# Altium schematic sheet Avalon_BP.SchDoc
size A4
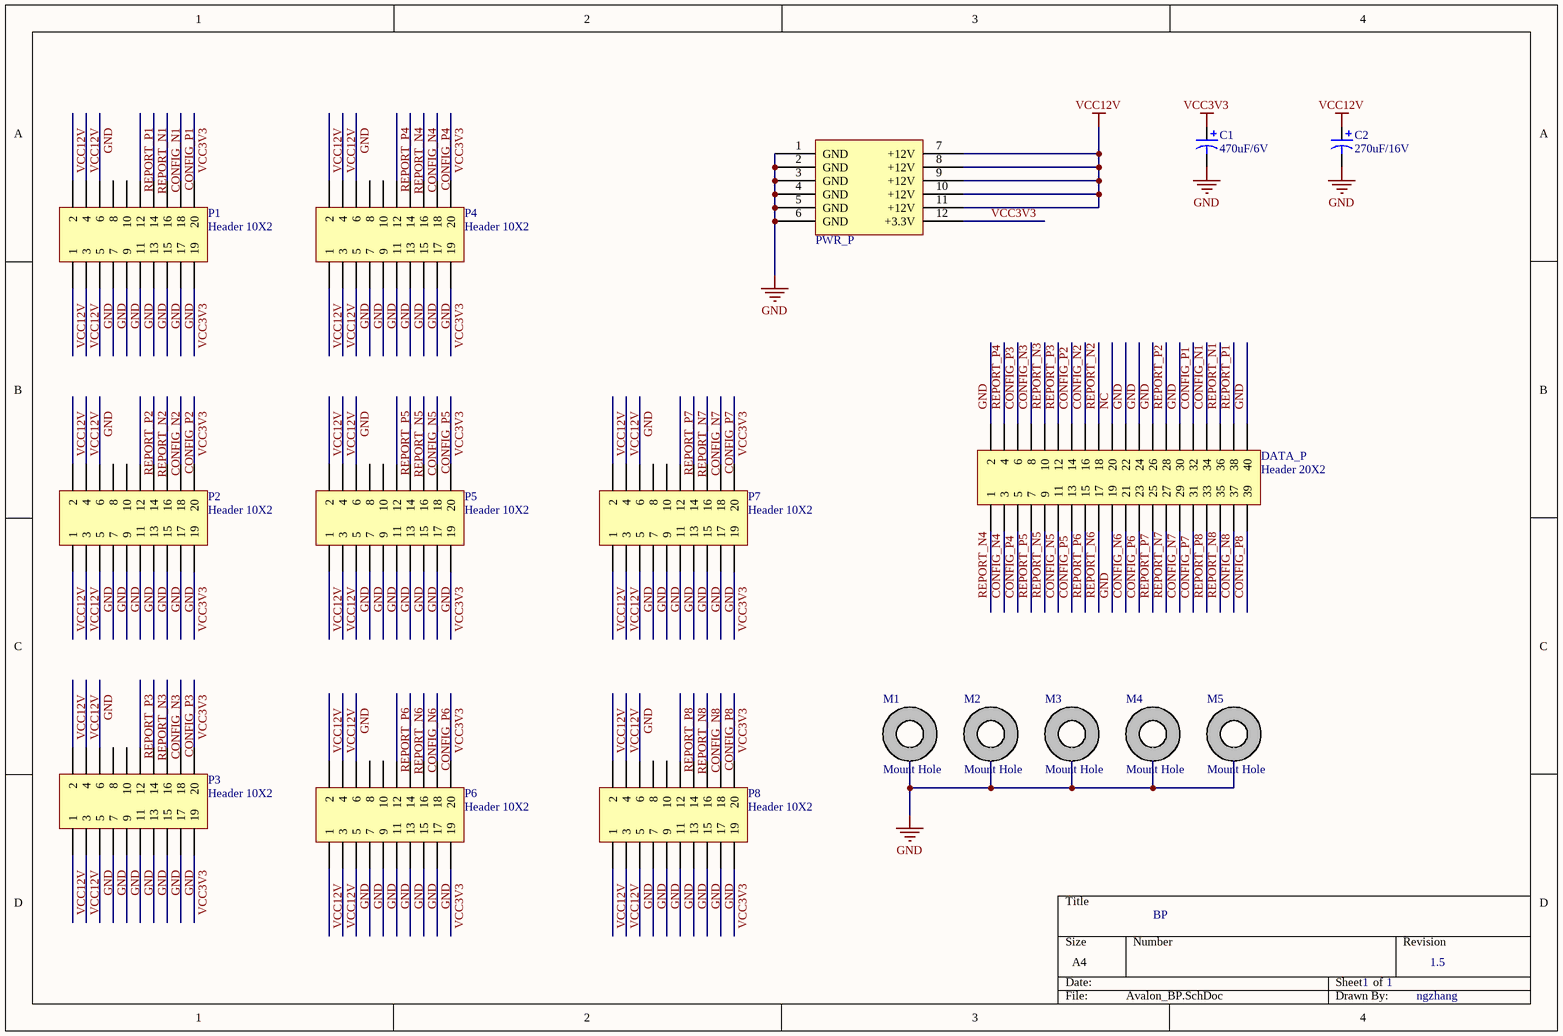
[diagram p0: Avalon_BP.SchDoc]

## Parts
C1  470uF/6V  [CAP8X8]
C2  270uF/16V  [CAP8X8]
DATA_P  Header 20X2  [IDE40]
M1  Mount Hole  [MHOLE3]
M2  Mount Hole  [MHOLE3]
M3  Mount Hole  [MHOLE3]
M4  Mount Hole  [MHOLE3]
M5  Mount Hole  [MHOLE3]
P1  Header 10X2  [HDR2X10]
P2  Header 10X2  [HDR2X10]
P3  Header 10X2  [HDR2X10]
P4  Header 10X2  [HDR2X10]
P5  Header 10X2  [HDR2X10]
P6  Header 10X2  [HDR2X10]
P7  Header 10X2  [HDR2X10]
P8  Header 10X2  [HDR2X10]
PWR_P  PWR_12P  [PWR_12PIN]  (value not drawn)

## Nets
GND: C1.2 C2.2 DATA_P.2 DATA_P.19 DATA_P.22 DATA_P.24 DATA_P.26 DATA_P.30 DATA_P.40 M1.0(PIN) M2.0(PIN) M3.0(PIN) M4.0(PIN) M5.0(PIN) P1.5 P1.6 P1.7 P1.9 P1.11 P1.13 P1.15 P1.17 P2.5 P2.6 P2.7 P2.9 P2.11 P2.13 P2.15 P2.17 P3.5 P3.6 P3.7 P3.9 P3.11 P3.13 P3.15 P3.17 P4.5 P4.6 P4.7 P4.9 P4.11 P4.13 P4.15 P4.17 P5.5 P5.6 P5.7 P5.9 P5.11 P5.13 P5.15 P5.17 P6.5 P6.6 P6.7 P6.9 P6.11 P6.13 P6.15 P6.17 P7.5 P7.6 P7.7 P7.9 P7.11 P7.13 P7.15 P7.17 P8.5 P8.6 P8.7 P8.9 P8.11 P8.13 P8.15 P8.17 PWR_P.1(GND) PWR_P.2(GND) PWR_P.3(GND) PWR_P.4(GND) PWR_P.5(GND) PWR_P.6(GND)
VCC3V3: C1.1 P1.19 P1.20 P2.19 P2.20 P3.19 P3.20 P4.19 P4.20 P5.19 P5.20 P6.19 P6.20 P7.19 P7.20 P8.19 P8.20 PWR_P.12(+3.3V)
VCC12V: C2.1 P1.1 P1.2 P1.3 P1.4 P2.1 P2.2 P2.3 P2.4 P3.1 P3.2 P3.3 P3.4 P4.1 P4.2 P4.3 P4.4 P5.1 P5.2 P5.3 P5.4 P6.1 P6.2 P6.3 P6.4 P7.1 P7.2 P7.3 P7.4 P8.1 P8.2 P8.3 P8.4 PWR_P.7(+12V) PWR_P.8(+12V) PWR_P.9(+12V) PWR_P.10(+12V) PWR_P.11(+12V)
CONFIG_N1: DATA_P.34 P1.16
CONFIG_N2: DATA_P.16 P2.16
CONFIG_N3: DATA_P.8 P3.16
CONFIG_N4: DATA_P.3 P4.16
CONFIG_N5: DATA_P.11 P5.16
CONFIG_N6: DATA_P.21 P6.16
CONFIG_N7: DATA_P.29 P7.16
CONFIG_N8: DATA_P.37 P8.16
CONFIG_P1: DATA_P.32 P1.18
CONFIG_P2: DATA_P.14 P2.18
CONFIG_P3: DATA_P.6 P3.18
CONFIG_P4: DATA_P.5 P4.18
CONFIG_P5: DATA_P.13 P5.18
CONFIG_P6: DATA_P.23 P6.18
CONFIG_P7: DATA_P.31 P7.18
CONFIG_P8: DATA_P.39 P8.18
NC: DATA_P.20
REPORT_N1: DATA_P.36 P1.14
REPORT_N2: DATA_P.18 P2.14
REPORT_N3: DATA_P.10 P3.14
REPORT_N4: DATA_P.1 P4.14
REPORT_N5: DATA_P.9 P5.14
REPORT_N6: DATA_P.17 P6.14
REPORT_N7: DATA_P.27 P7.14
REPORT_N8: DATA_P.35 P8.14
REPORT_P1: DATA_P.38 P1.12
REPORT_P2: DATA_P.28 P2.12
REPORT_P3: DATA_P.12 P3.12
REPORT_P4: DATA_P.4 P4.12
REPORT_P5: DATA_P.7 P5.12
REPORT_P6: DATA_P.15 P6.12
REPORT_P7: DATA_P.25 P7.12
REPORT_P8: DATA_P.33 P8.12

Not connected (* = marked no-connect by the designer): P1 8 10; P2 8 10; P3 8 10; P4 8 10; P5 8 10; P6 8 10; P7 8 10; P8 8 10

## Notes on the sheet
- BP
- 1      1
- 1.5
- ngzhang

## Library data of the parts
C1 C2 = Cap Pol3: Polarized Capacitor (Surface Mount); Published: 8-Jun-2000; LatestRevisionDate: 29-May-2009; LatestRevisionNote: IPC-7351 Footprint Added.; PackageReference: C0805; Publisher: Altium Limited; PackageDescription: Chip Capacitor
  C1: Value: 470uF/6V
  C2: Value: 270uF/16V
DATA_P = Header 20X2: Header, 20-Pin, Dual row; LatestRevisionDate: 17-Jul-2002; LatestRevisionNote: Re-released for DXP Platform.; Publisher: Altium Limited
M1-M5 = M_Hole
P1-P8 = Header 10X2: Header, 10-Pin, Dual row; LatestRevisionDate: 17-Jul-2002; LatestRevisionNote: Re-released for DXP Platform.; Publisher: Altium Limited